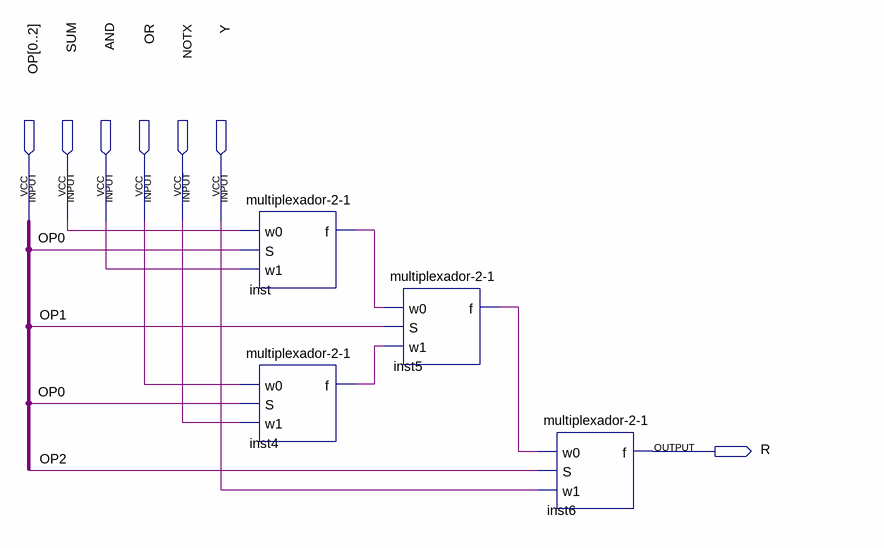
[diagram p0: schematic sheet]
// Quartus schematic mux5x1.bdf as structural Verilog: 4 symbols, 7 pins
module mux5x1 (
  input  [0:2] OP,
  input  SUM,
  input  AND,
  input  OR,
  input  NOTX,
  input  Y,
  output R
);

  wire inst4_f, inst5_f, inst_f;

  \multiplexador-2-1  inst (.w0(SUM), .S(OP[0]), .w1(AND), .f(inst_f));
  \multiplexador-2-1  inst4 (.w0(OR), .S(OP[0]), .w1(NOTX), .f(inst4_f));
  \multiplexador-2-1  inst5 (.w0(inst_f), .S(OP[1]), .w1(inst4_f), .f(inst5_f));
  \multiplexador-2-1  inst6 (.w0(inst5_f), .S(OP[2]), .w1(Y), .f(R));
endmodule
